# Altium schematic sheet Camera_Shield_Power.SchDoc: Power
size B; CompanyName: Cospan Design; DrawnBy: David McCoy; Engineer: David McCoy; Organization: Cospan Design; DocumentNumber: 4; Revision: .revision; SheetNumber: 4; SheetTotal: 4
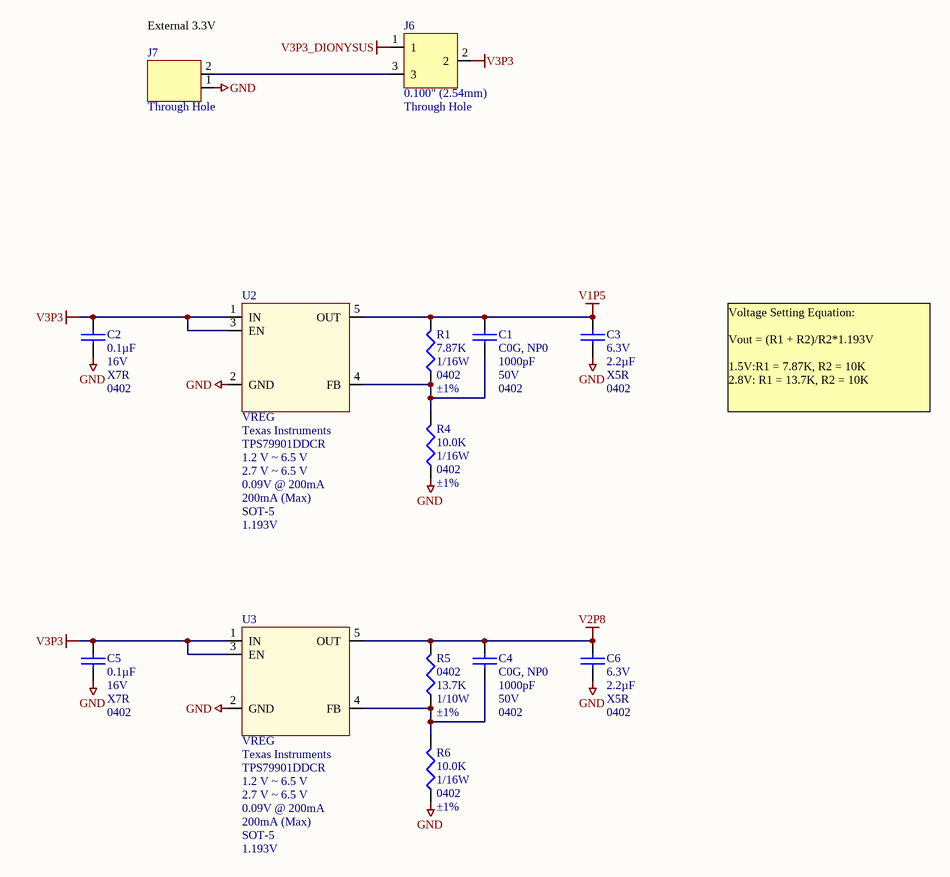
[diagram p0: Camera_Shield_Power.SchDoc]

## Parts
C1  Temperature Coefficient: C0G, NP0  Voltage - Rated: 50V  Package / Case: 0402  [C_ERA-0402]  (hidden comment: 1000pF)
C2  Capacitance: 0.1µF  Voltage - Rated: 16V  Temperature Coefficient: X7R  Package / Case: 0402  [C_0402]  (hidden comment: 0.1uF)
C3  Voltage - Rated: 6.3V  Capacitance: 2.2µF  Temperature Coefficient: X5R  Package / Case: 0402  [C_ERA-0402]  (hidden comment: 2.2uF)
C4  Temperature Coefficient: C0G, NP0  Voltage - Rated: 50V  Package / Case: 0402  [C_ERA-0402]  (hidden comment: 1000pF)
C5  Capacitance: 0.1µF  Voltage - Rated: 16V  Temperature Coefficient: X7R  Package / Case: 0402  [C_0402]  (hidden comment: 0.1uF)
C6  Voltage - Rated: 6.3V  Capacitance: 2.2µF  Temperature Coefficient: X5R  Package / Case: 0402  [C_ERA-0402]  (hidden comment: 2.2uF)
J6  Pitch: 0.100" (2.54mm)  Mounting Type: Through Hole  [HDR_1X3]  (hidden comment: J_HDR1X3_JUMPER_SELECT)
J7  Mounting Type: Through Hole  [HDR_1X2]  (hidden comment: J_HDR1X2_JUMPER)
R1  Resistance In Ohms: 7.87K  Power (Watts): 1/16W  Case: 0402  Tolerance: ±1%  [R_0402]  (hidden comment: R_0402_7.87K)
R4  Resistance In Ohms: 10.0K  Power (Watts): 1/16W  Case: 0402  Tolerance: ±1%  [ERA-0402]  (hidden comment: R_0402_10.0K)
R5  Package / Case: 0402  Resistance (Ohms): 13.7K  Power (Watts): 1/10W  Tolerance: ±1%  [ERA-0402]  (hidden comment: R_0402_13.7K)
R6  Resistance In Ohms: 10.0K  Power (Watts): 1/16W  Case: 0402  Tolerance: ±1%  [ERA-0402]  (hidden comment: R_0402_10.0K)
U2  VREG  Manufacturer: Texas Instruments  Manufacturer Part Number: TPS79901DDCR  Voltage - Output: 1.2 V ~ 6.5 V  Voltage - Input: 2.7 V ~ 6.5 V  Voltage - Dropout (Typical): 0.09V @ 200mA  Current - Output: 200mA (Max)  Supplier Device Package: SOT-5  VREF: 1.193V  [SOT95P280X90-5N]
U3  VREG  Manufacturer: Texas Instruments  Manufacturer Part Number: TPS79901DDCR  Voltage - Output: 1.2 V ~ 6.5 V  Voltage - Input: 2.7 V ~ 6.5 V  Voltage - Dropout (Typical): 0.09V @ 200mA  Current - Output: 200mA (Max)  Supplier Device Package: SOT-5  VREF: 1.193V  [SOT95P280X90-5N]

## Nets
GND: C2.1 C3.1 C5.1 C6.1 J7.1 R4.2 R6.2 U2.2(GND) U3.2(GND)
V1P5: C1.2 C3.2 R1.1 U2.5(OUT)
V2P8: C4.2 C6.2 R5.1 U3.5(OUT)
V3P3: C2.2 C5.2 J6.2 U2.1(IN) U2.3(EN) U3.1(IN) U3.3(EN)
V3P3_DIONYSUS: J6.1
NetC1_1: C1.1 R1.2 R4.1 U2.4(FB)
NetC4_1: C4.1 R5.2 R6.1 U3.4(FB)
NetJ6_3: J6.3 J7.2

## Notes on the sheet
- (near J7) External 3.3V
- Voltage Setting Equation:
  Vout = (R1 + R2)/R2*1.193V
  1.5V:R1 = 7.87K, R2 = 10K
  2.8V: R1 = 13.7K, R2 = 10K
- Title:
- http://www.cospandesign.com
- Cospan Design
- Project:
- Document:
- Engineer:
- Drawn By:
- Approved By:
- Revision:
- Date:
- Number:
- of

## Library data of the parts
C1 C4 = C_0402_1000PF_50V: CAP CER 1000PF 50V C0G 0402; Manufacturer: Murata Electronics North America; Manufacturer Part Number: GRM1555C1H102JA01D; Tolerance: ±5%; Supplier 1: Digi-Key; RoHS: RoHS Compliant; Category: Capacitors; Stock 1: 1327660; Pricing 1: 10=0.073, 100=0.0429, 500=0.02476, 1000=0.01716 (USD); Mounting Type: Surface Mount, MLCC; Operating Temperature: -55°C ~ 125°C; Features: -; Applications: General Purpose; Ratings: -; Size / Dimension: 0.040" L x 0.020" W (1.00mm x 0.50mm); Lead Spacing: -; Thickness: 0.50mm; Packaging: Cut Tape (CT); Lead Style: -; ComponentLink1URL: http://search.murata.co.jp/Ceramy/image/img/PDF/ENG/GRM1555C1H102JA01.pdf; ComponentLink1Description: http://search.murata.co.jp/Ceramy/image/img/PDF/ENG/GRM1555C1H102JA01.pdf; Supplier Part Number 1: 490-3244-1-ND; Capacitance: 1000pF; COST_1: *; COST_100: *; COST_1000: *; MANF1: *; MANF1_PN: *; MANF2: *; MANF2_PN: *; MANF3: *; MANF3_PN: *; VENDOR1: *; VENDOR1_PN: *
C2 C5 = C_0402_0.1UF_16V: CAP CER .10UF 16V X7R 0402; Manufacturer: TDK Corporation; Manufacturer Part Number: C1005X7R1C104K; Tolerance: ±10%; Supplier 1: Digi-Key; Supplier Part Number 1: 445-4952-1-ND; RoHS: RoHS Compliant; Category: Capacitors; Stock 1: 230800; Pricing: 10=0.024, 100=0.0143, 500=0.00826, 1000=0.00572 (USD); Mounting Type: Surface Mount, MLCC; Features: General Purpose; Lead Spacing: -; Thickness: 0.50mm; Packaging: Cut Tape (CT); ComponentLink1URL: http://www.tdk.co.jp/tefe02/e412_c.pdf; ComponentLink1Description: http://www.tdk.co.jp/tefe02/e412_c.pdf; Operating Temperature: -55°C ~ 125°C
C3 C6 = C_0402_2.2UF: CAP CER 2.2UF 6.3V X5R 0402; Manufacturer: TDK Corporation; Manufacturer Part Number: C1005X5R0J225M; Tolerance: ±20%; Supplier 1: Digi-Key; Supplier Part Number 1: 445-4999-1-ND; RoHS: RoHS Compliant; Category: Capacitors; Stock 1: 511888; Pricing: 1=0.44, 10=0.33, 100=0.154, 250=0.11, 500=0.0748, 1000=0.0605 (USD); Mounting Type: Surface Mount, MLCC; Operating Temperature: -55°C ~ 85°C; Applications: General Purpose; Ratings: -; Size / Dimension: 0.039" L x 0.020" W (1.00mm x 0.50mm); Height: -; Thickness: 0.022" (0.55mm); Lead Spacing: -; Features: -; Packaging: Cut Tape (CT); Lead Style: -; ComponentLink1URL: http://www.tdk.co.jp/tefe02/e412_c.pdf; ComponentLink1Description: http://www.tdk.co.jp/tefe02/e412_c.pdf; COST_1: *; COST_100: *; COST_1000: *; MANF1: *; MANF1_PN: *; MANF2: *; MANF2_PN: *; MANF3: *; MANF3_PN: *; VENDOR1: *; VENDOR1_PN: *
J6 = J_HDR1X3_JUMPER_SELECT: CONN HEADER .100" 3POS TIN PCB; Manufacturer: Samtec; Manufacturer Part Number: TSW-103-07-T-S; Connector Type: Unshrouded; Number of Positions: 3; Number of Positions Loaded: All; Supplier 1: Samtec; Supplier Part Number 1: TSW-103-07-T-S; Category: Connectors, Interconnects; Number of Rows: 1; Height Stacking (Mating): -; Height Above Board: 0.100" (2.54mm); Contact Mating Length: 0.166" (4.22mm); Contact Finish: Tin; Contact Finish Thickness: 200µin (5.08µm); Features: -; Color: Black; ComponentLink1URL: http://www.samtec.com/ftppub/cpdf/TX-MKT1.PDF; ComponentLink1Description: http://www.samtec.com/ftppub/cpdf/TX-MKT1.PDF; Pricing: 1=0.101
J7 = J_HDR1X2_JUMPER: CONN HEADER .100" 2POS TIN PCB; Manufacturer: Samtec; Manufacturer Part Number: TSW-102-07-T-S; Number of Positions: 2; Connector Type: Unshrouded; Number of Positions Loaded: All; Pitch: 0.100" (2.54mm); NOTE: This is a 1X12 header; Category: Connectors, Interconnects; Number of Rows: 1; Supplier 1: Samtec; Supplier Part Number 1: TSW-102-07-T-S; RoHS: RoHS Compliant; Row Spacing: -; Height Stacking (Mating): -; Molding Height Above Board: 0.100" (2.54mm); Contact Mating Length: 0.166" (4.22mm); Termination: Solder; Contact Finish: Tin; Contact Finish Thickness: 200µin (5.08µm); Features: -; Color: Black; ComponentLink1URL: http://www.samtec.com/ftppub/pdf/TD.PDF; ComponentLink1Description: http://www.samtec.com/ftppub/pdf/TD.PDF
R1 = R_0402_7.87K: RES 7.87K OHM 1/16W 1% 0402 SMD; Manufacturer: Yageo; Manufacturer Part Number: RC0402FR-077K87L; Temperature Coefficient: ±100ppm/°C; Supplier 1: Digi-Key; Supplier Part Number 1: 311-7.87KLRCT-ND; RoHS: RoHS Compliant; Category: Resistors; Stock 1: 36940; Pricing: 10=0.014, 50=0.0104, 100=0.0079, 250=0.00584, 500=0.00432, 1000=0.00288 (USD); Resistance (Ohms): 7.87K; Composition: Thick Film; Features: -; Size / Dimension: 0.039" L x 0.020" W (1.00mm x 0.50mm); Height: 0.016" (0.40mm); Number of Terminations: 2; Packaging: Cut Tape (CT); Package / Case: 0402 (1005 Metric); ComponentLink1URL: http://www.yageo.com/documents/recent/PYu-RC0402_51_RoHS_L_6.pdf; ComponentLink1Description: http://www.yageo.com/documents/recent/PYu-RC0402_51_RoHS_L_6.pdf; COST_1: *; COST_100: *; COST_1000: *; MANF1: *; MANF1_PN: *; MANF2: *; MANF2_PN: *; MANF3: *; MANF3_PN: *; VENDOR1: *; VENDOR1_PN: *
R4 R6 = R_0402_10.0K: RES 10.0K OHM 1/16W 1% 0402 SMD; Manufacturer: Stackpole Electronics Inc; Manufacturer Part Number: RMCF0402FT10K0; Resistance (Ohms): 10k; Temperature Coefficient: ±100ppm/°C; Supplier 1: Digi-Key; Supplier Part Number 1: RMCF0402FT10K0CT-ND; RoHS: RoHS Compliant; Category: Resistors; Stock 1: 234525; Pricing: 1=0.04, 10=0.025, 50=0.0138, 100=0.0105, 250=0.0078, 500=0.00576, 1000=0.00384, 2500=0.00324, 5000=0.0027 (USD); Composition: Thick Film; Features: -; Package / Case: 0402 (1005 Metric); Size / Dimension: 0.039" L x 0.020" W (1.00mm x 0.50mm); Height: 0.016" (0.40mm); Number of Terminations: 2; Packaging: Cut Tape (CT); ComponentLink1URL: http://www.seielect.com/Catalog/SEI-RMCF_RMCP.pdf; ComponentLink1Description: http://www.seielect.com/Catalog/SEI-RMCF_RMCP.pdf
R5 = R_0402_13.7K: RES 13.7K OHM 1/10W 1% 0402 SMD; Manufacturer: Panasonic - ECG; Manufacturer Part Number: ERJ-2RKF1372X; Temperature Coefficient: ±100ppm/°C; Supplier 1: Digi-Key; Supplier Part Number 1: P13.7KLCT-ND; RoHS: RoHS Compliant; Category: Resistors; Stock 1: 187486; Pricing: 1=0.06, 50=0.0242, 100=0.0184, 250=0.01364, 500=0.01008, 1000=0.00672, 5000=0.00473 (USD); Composition: Thick Film; Features: -; Size / Dimension: 0.039" L x 0.020" W (1.00mm x 0.50mm); Height: 0.016" (0.40mm); Number of Terminations: 2; Packaging: Cut Tape (CT); ComponentLink1URL: http://industrial.panasonic.com/www-cgi/jvcr13pz.cgi?E+PZ+3+AOA0002+ERJ2RKF1372X+7+WW; ComponentLink1Description: http://industrial.panasonic.com/www-cgi/jvcr13pz.cgi?E+PZ+3+AOA0002+ERJ2RKF1372X+7+WW
U2 U3 = U_TPS79901DDCR: IC REG LDO ADJ .2A TSOT-23-5; Regulator Topology: Positive Adjustable; Number of Regulators: 1; Current - Limit (Min): 200mA; Supplier 1: Digi-Key; Supplier Part Number 1: 296-17776-1-ND; RoHS: RoHS Compliant; Category: Integrated Circuits (ICs); Stock 1: 8553; Pricing: 1=0.96, 10=0.849, 25=0.766, 100=0.6703, 250=0.58788, 500=0.52136, 1000=0.4123 (USD); Operating Temperature: -40°C ~ 125°C; Mounting Type: Surface Mount; Package / Case: SOT-23-5 Thin, TSOT-23-5; Packaging: Cut Tape (CT); ComponentLink1URL: http://www.ti.com/lit/ds/symlink/tps79913.pdf; ComponentLink1Description: http://www.ti.com/lit/ds/symlink/tps79913.pdf